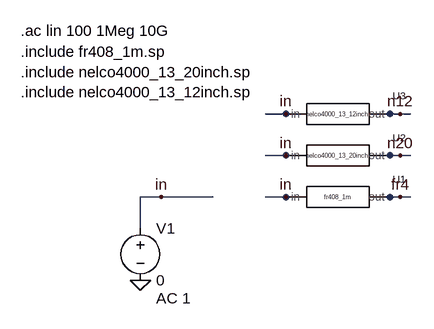
[diagram p0: schematic Channel_model_AC.asc]
Channel_model_AC.asc, the LTspice schematic file:
Version 4.1
SHEET 1 880 680
WIRE 272 -64 240 -64
WIRE 304 -64 272 -64
WIRE 448 -64 400 -64
WIRE 464 -64 448 -64
WIRE 272 0 240 0
WIRE 304 0 272 0
WIRE 448 0 400 0
WIRE 464 0 448 0
WIRE 80 64 48 64
WIRE 160 64 80 64
WIRE 272 64 240 64
WIRE 304 64 272 64
WIRE 448 64 400 64
WIRE 464 64 448 64
WIRE 48 112 48 64
FLAG 48 192 0
FLAG 80 64 in
FLAG 448 64 fr4
FLAG 272 64 in
FLAG 448 0 n20
FLAG 272 0 in
FLAG 448 -64 n12
FLAG 272 -64 in
SYMBOL voltage 48 96 R0
WINDOW 123 24 124 Left 2
WINDOW 39 0 0 Left 0
SYMATTR InstName V1
SYMATTR Value 0
SYMATTR Value2 AC 1
SYMBOL channel 352 64 R0
SYMATTR SpiceModel fr408_1m
SYMATTR InstName U1
SYMBOL channel 352 0 R0
SYMATTR SpiceModel nelco4000_13_20inch
SYMATTR InstName U2
SYMBOL channel 352 -64 R0
SYMATTR SpiceModel nelco4000_13_12inch
SYMATTR InstName U3
TEXT -136 -160 Left 2 !.include fr408_1m.sp\n.include nelco4000_13_20inch.sp\n.include nelco4000_13_12inch.sp
TEXT -136 -192 Left 2 !.ac lin 100 1Meg 10G

The netlist it stands for:
* Channel_model_AC.asc
V1 in 0 0 AC 1
X§U1 in fr4 fr408_1m  ; pins in out
X§U2 in n20 nelco4000_13_20inch  ; pins in out
X§U3 in n12 nelco4000_13_12inch  ; pins in out
.include fr408_1m.sp
.include nelco4000_13_20inch.sp
.include nelco4000_13_12inch.sp
.ac lin 100 1Meg 10G
.backanno
.end